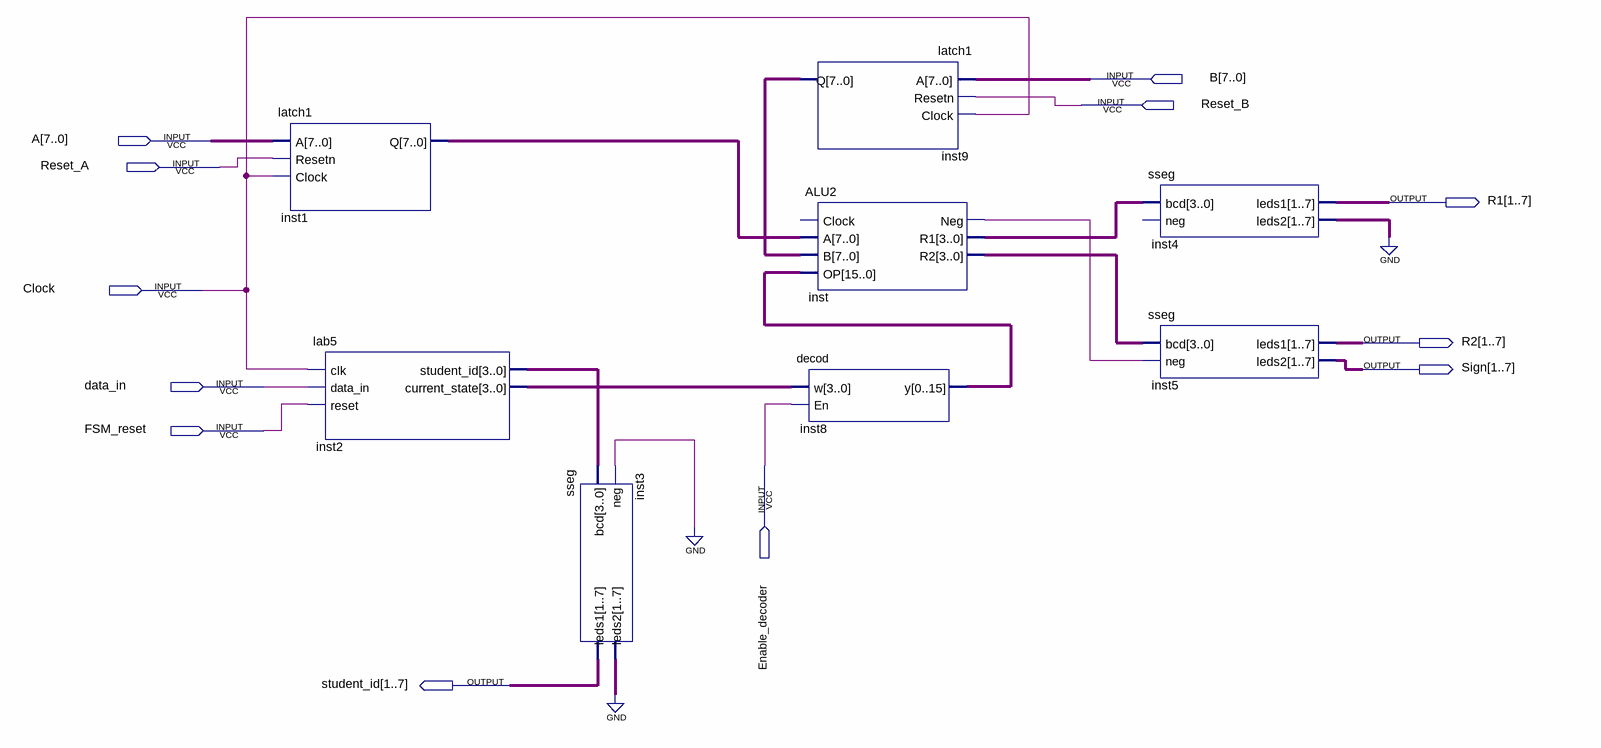
[diagram p0: schematic sheet]
// Quartus schematic Problem2.bdf as structural Verilog: 8 symbols, 12 pins
module Problem2 (
  input  [7:0] B,
  input  Reset_B,
  input  [7:0] A,
  input  Reset_A,
  input  Clock,
  input  data_in,
  input  FSM_reset,
  input  Enable_decoder,
  output [1:7] R1,
  output [1:7] R2,
  output [1:7] Sign,
  output [1:7] student_id
);

  wire inst_neg;
  wire [3:0] inst2_current_state, inst2_student_id, inst_r1, inst_r2;
  wire [6:0] inst3_leds2, inst4_leds2;
  wire [7:0] inst1_q, inst9_q;
  wire [15:0] inst8_y;

  latch1 inst1 (.A(A), .Resetn(Reset_A), .Clock(Clock), .Q(inst1_q));
  lab5 inst2 (
    .clk(Clock), .data_in(data_in), .reset(FSM_reset), .student_id(inst2_student_id),
    .current_state(inst2_current_state));
  sseg inst3 (.bcd(inst2_student_id), .neg(1'b0), .leds1(student_id), .leds2(inst3_leds2));
  latch1 inst9 (.A(B), .Resetn(Reset_B), .Clock(Clock), .Q(inst9_q));
  ALU2 inst (.A(inst1_q), .B(inst9_q), .OP(inst8_y), .Neg(inst_neg), .R1(inst_r1), .R2(inst_r2));  // open: Clock
  decod inst8 (.w(inst2_current_state), .En(Enable_decoder), .y(inst8_y));
  sseg inst4 (.bcd(inst_r1), .leds1(R1), .leds2(inst4_leds2));  // open: neg
  sseg inst5 (.bcd(inst_r2), .neg(inst_neg), .leds1(R2), .leds2(Sign));
  // also tied to GND on the sheet: {inst3_leds2[0], inst3_leds2[1], inst3_leds2[2], inst3_leds2[3], inst3_leds2[4], inst3_leds2[5], inst3_leds2[6], inst4_leds2[0], inst4_leds2[1], inst4_leds2[2], inst4_leds2[3], inst4_leds2[4], inst4_leds2[5], inst4_leds2[6]}
endmodule
